# EAGLE board r (EAGLE 9.6.2), part 1 of 2
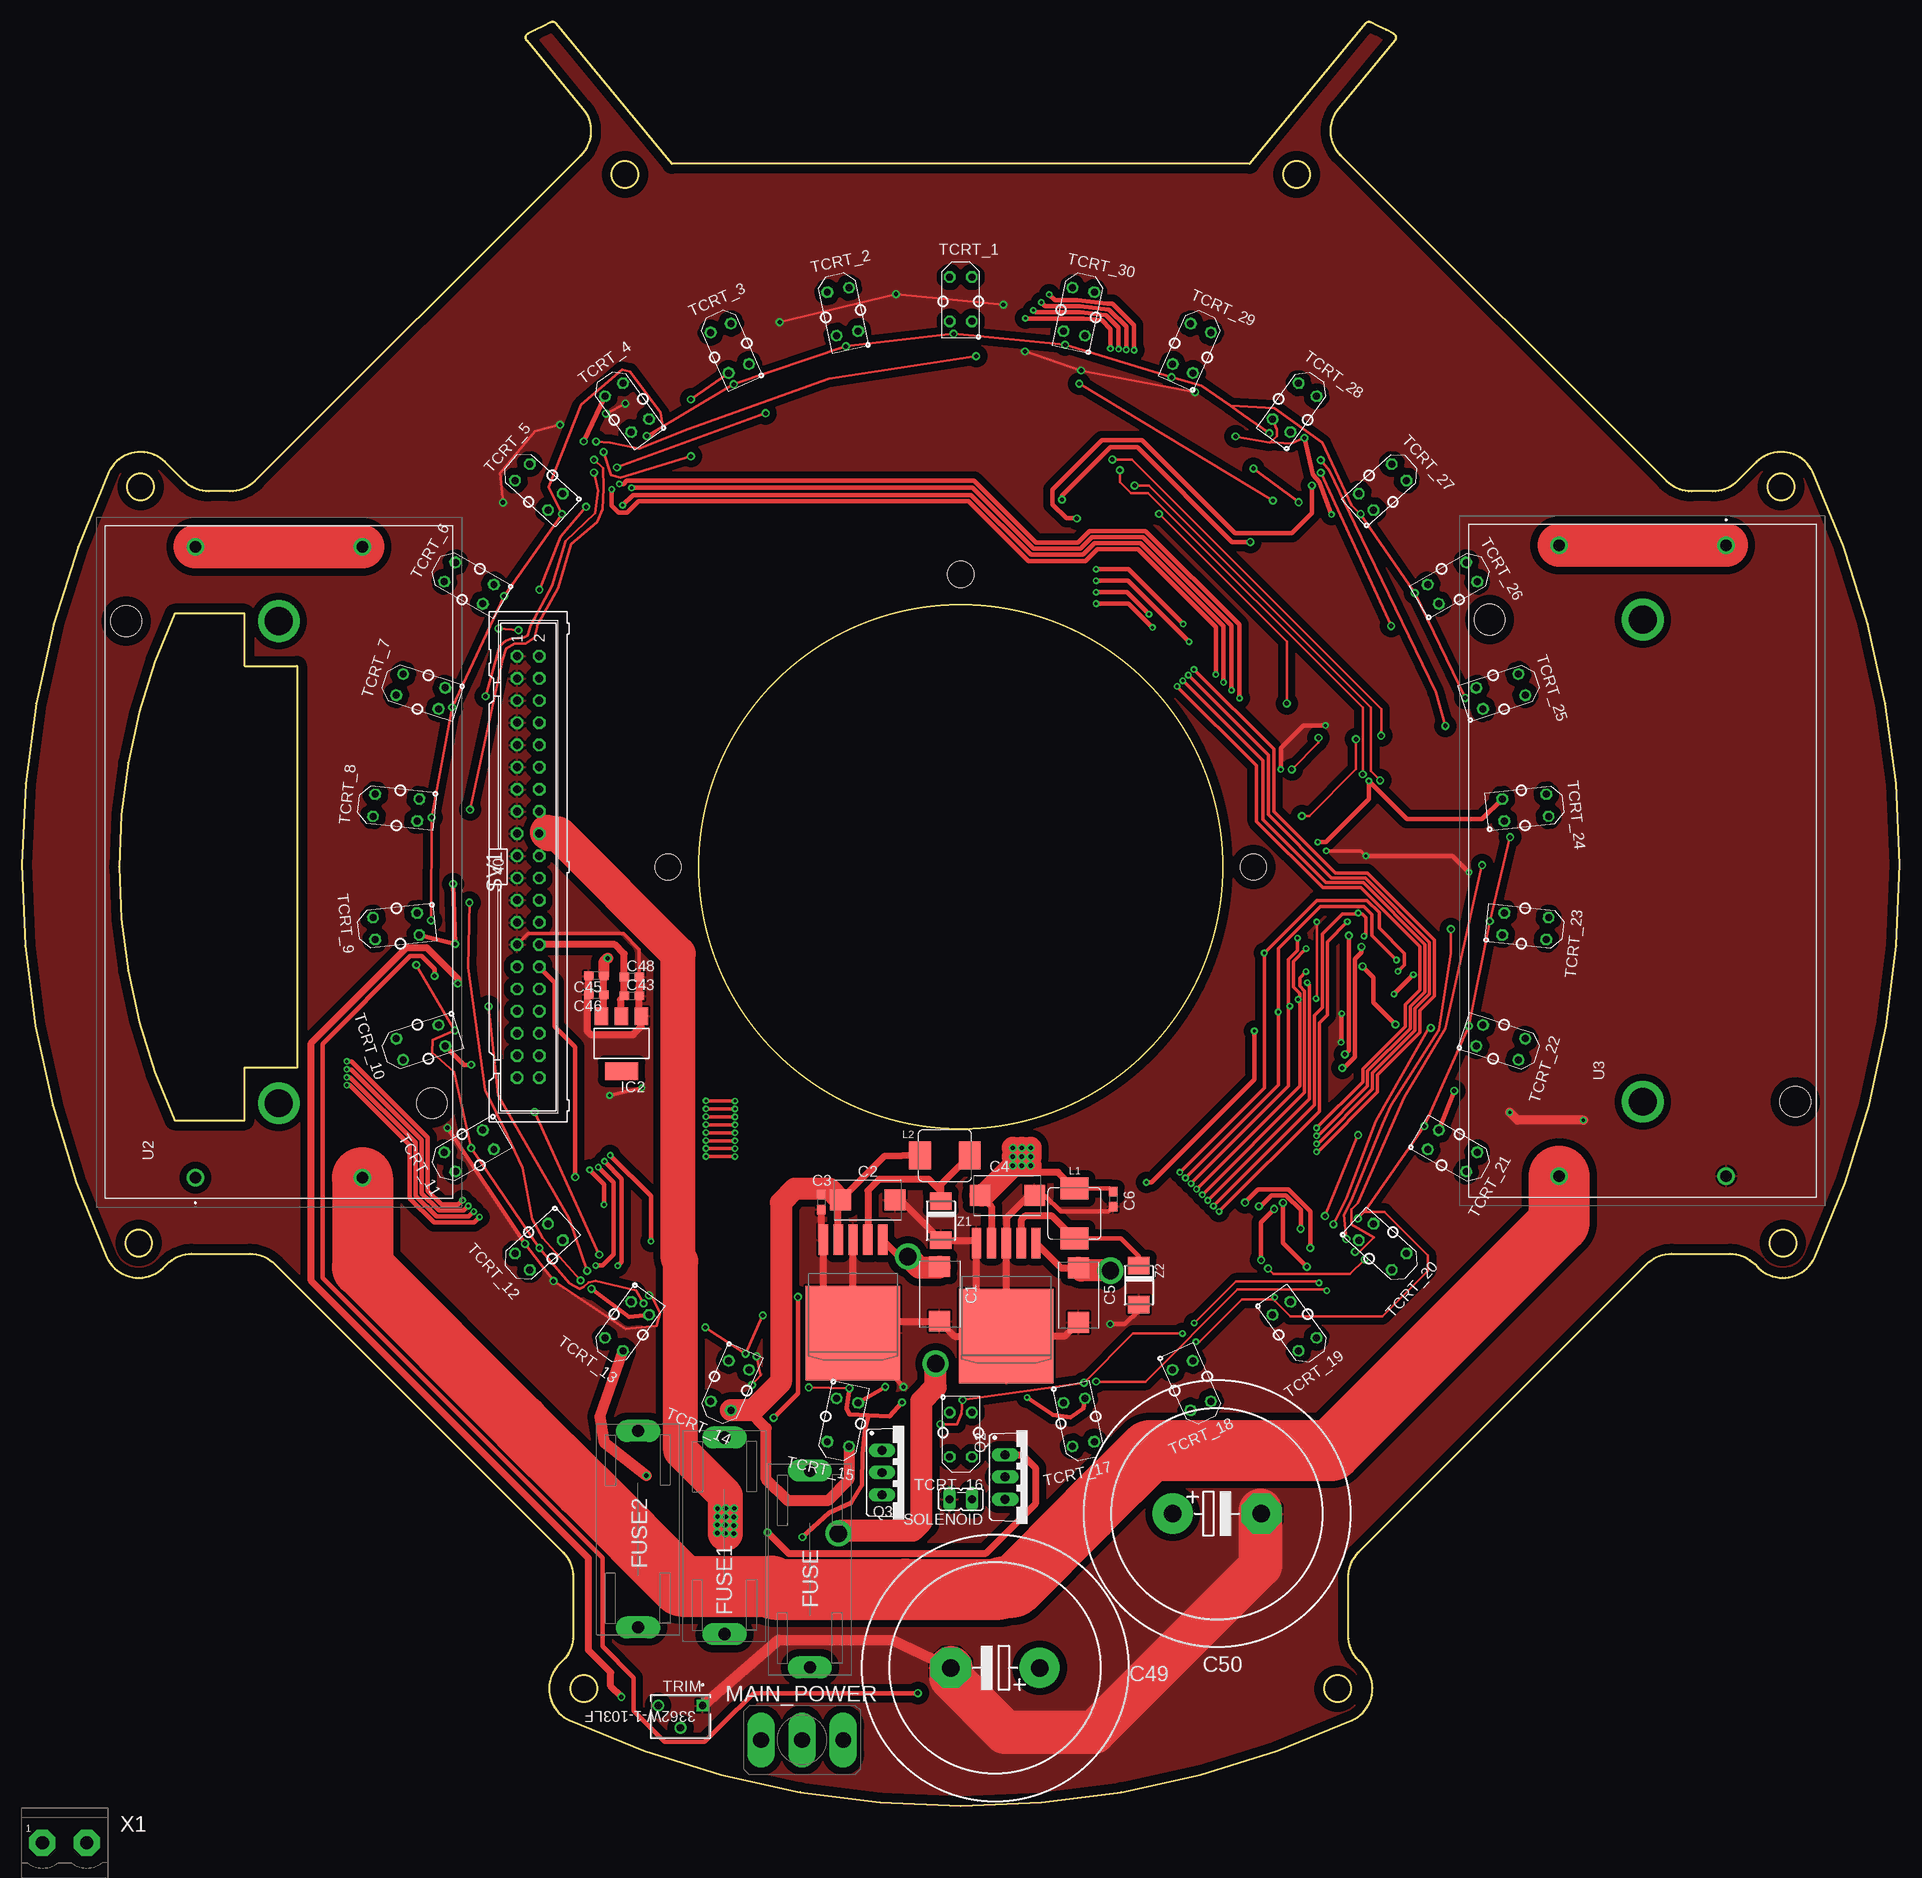
[diagram p2: board, top side]
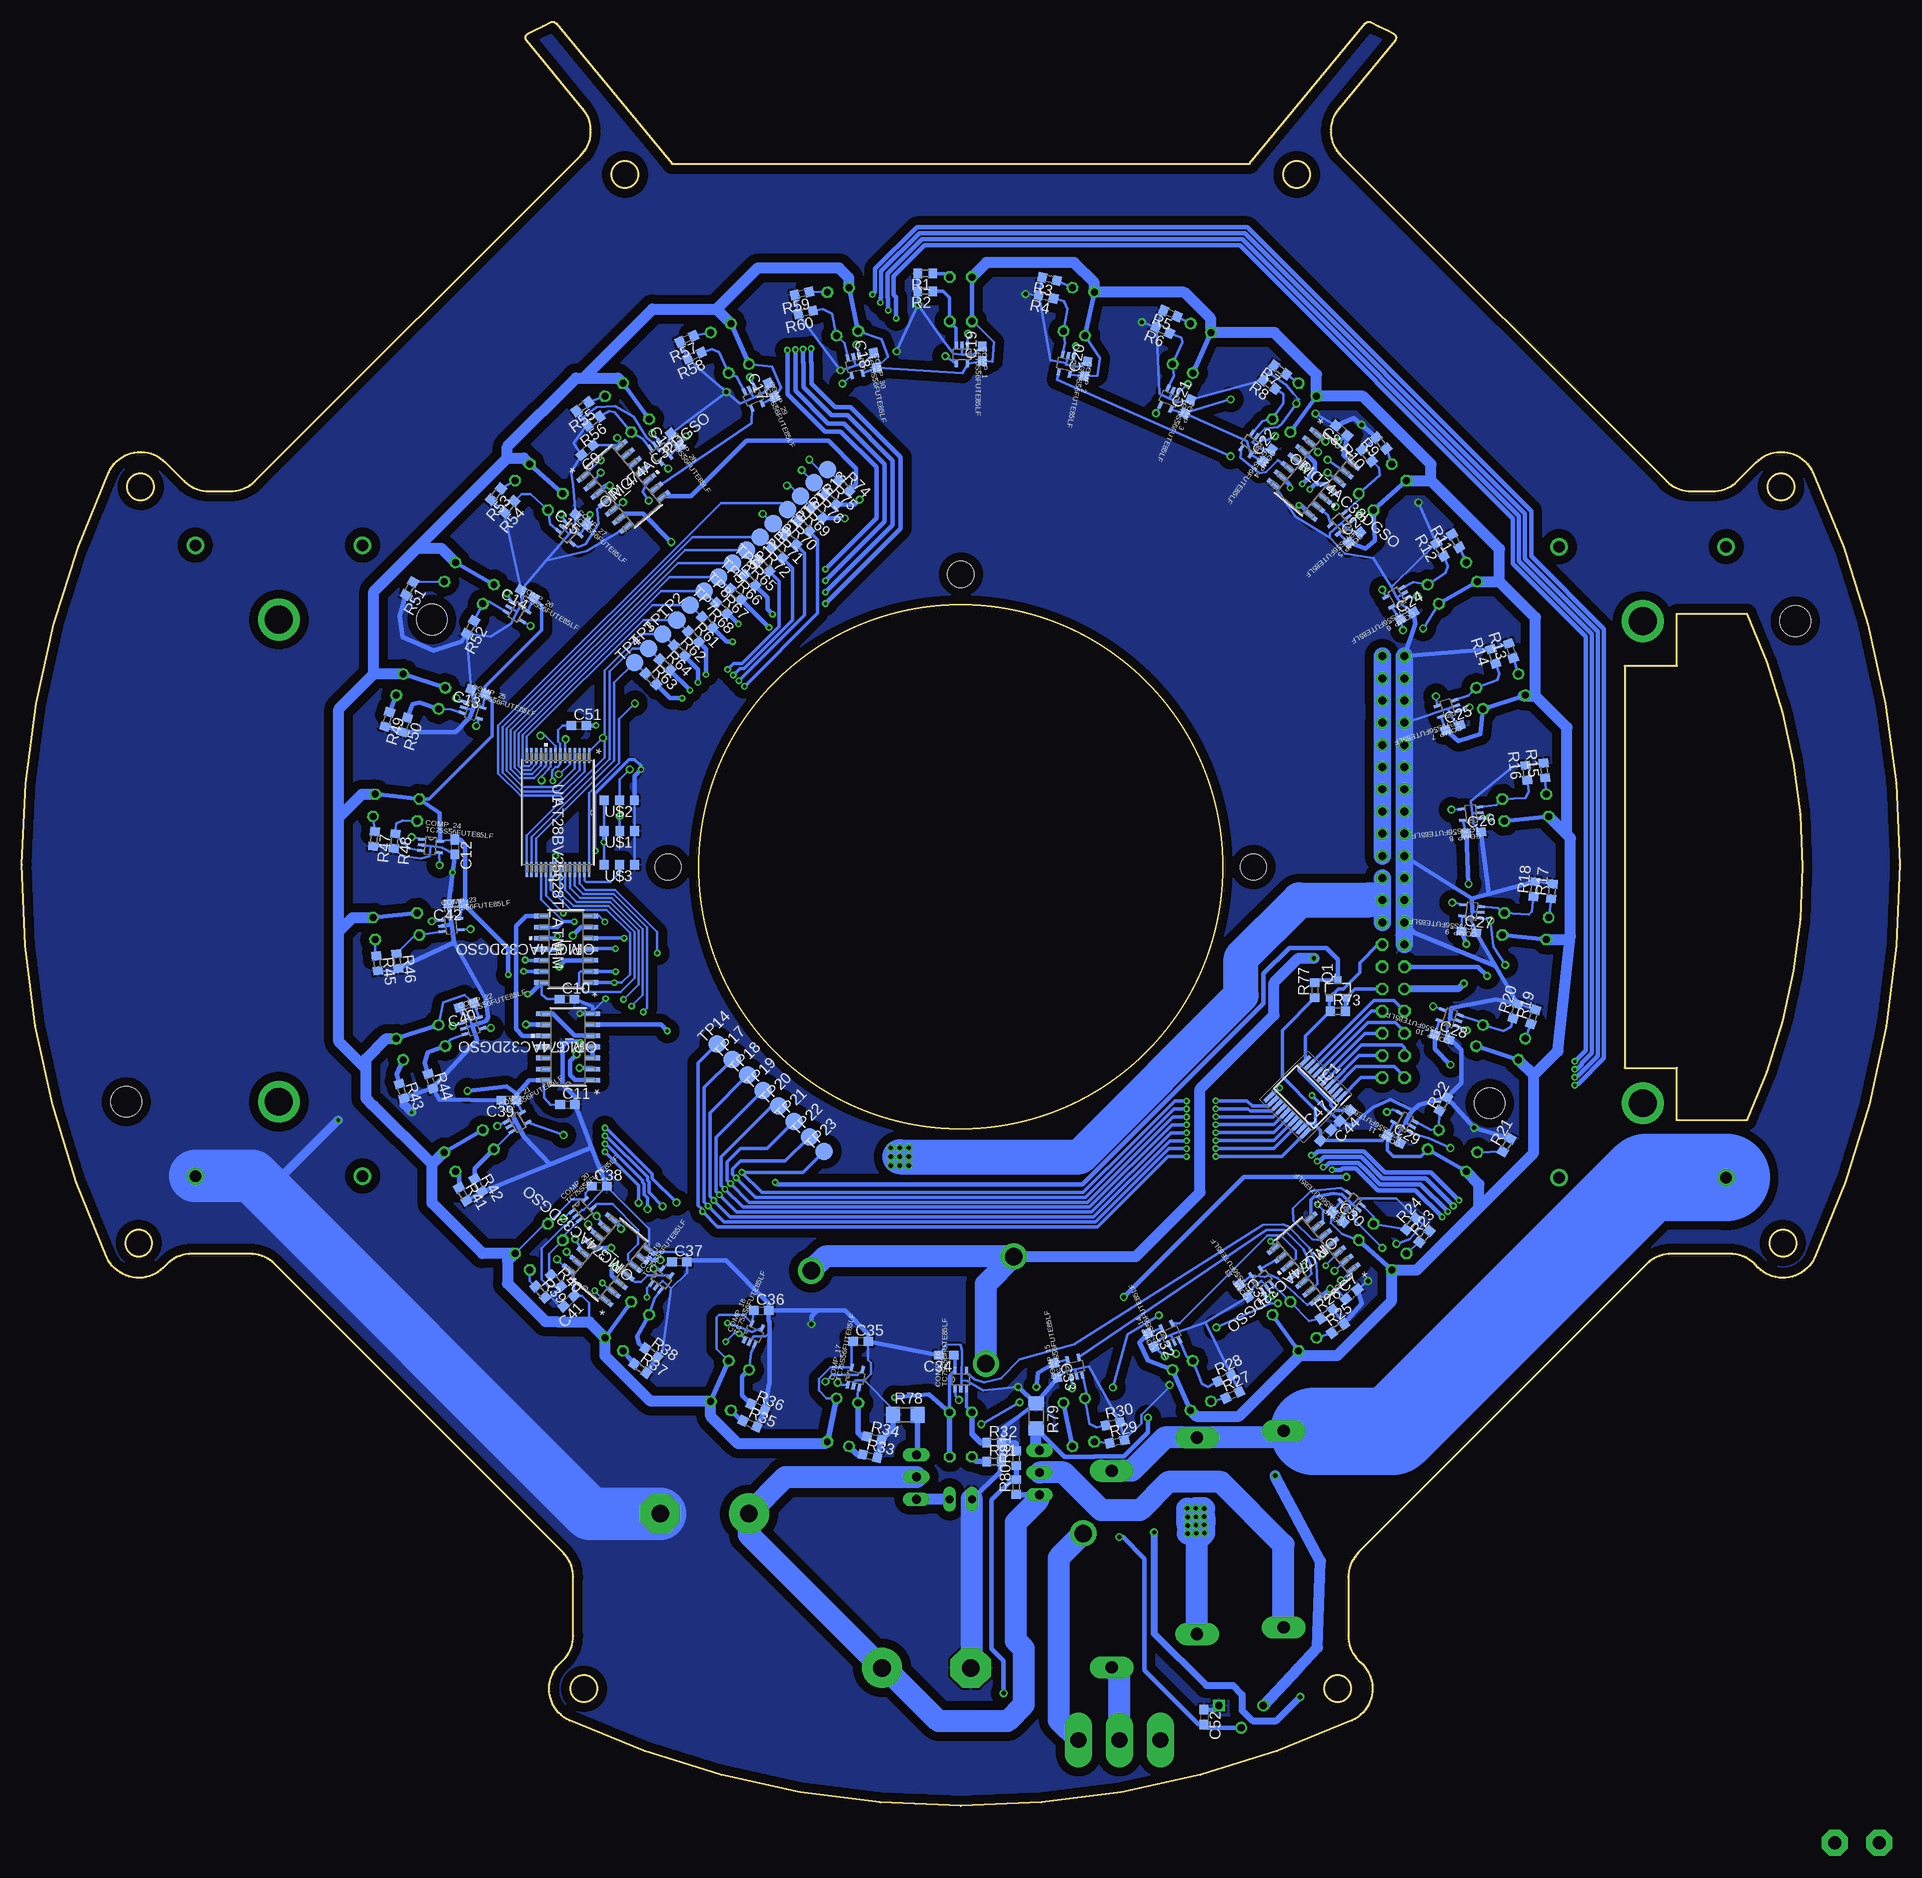
[diagram p3: board, bottom side, seen from below]

Size 215 x 204.26 mm. Coordinates in mm from the lower left corner, seen from the top.
Outline: 140.55,188 74.44,188 61.15,204.08 arc76 60.55,204.21 arc2 57.92,202.89 arc102 57.77,202.12 64.23,194.31 arc-85 63.97,188.94 26.67,151.67 arc-45 23.84,150.5 21.42,150.5 arc-45 18.59,151.67 16.42,153.84 arc110 9.96,152.7 arc49 9.74,62.79 arc110 16.2,61.62 16.62,62.03 arc-45 19.44,63.2 26.13,63.2 arc-45 28.96,62.03 61.96,29 arc-45 63.13,26.18 63.13,19.49 arc-45 61.95,16.66 61.54,16.25 arc110 62.7,9.78 arc49 152.3,9.78 arc110 153.46,16.25 153.04,16.66 arc-45 151.87,19.49 151.87,26.18 arc-45 153.04,29 186.04,62.03 arc-45 188.87,63.2 195.55,63.2 arc-45 198.38,62.03 198.79,61.62 arc110 205.26,62.79 arc49 205.04,152.7 arc110 198.58,153.84 196.41,151.67 arc-45 193.58,150.5 191.16,150.5 arc-45 188.33,151.67 151.03,188.94 arc-85 150.77,194.31 157.23,202.12 arc102 157.08,202.89 arc2 154.45,204.21 arc76 153.84,204.08 140.55,188
Outline: 17.5,136.5 arc49 17.5,78.5 25.5,78.5 25.5,84.5 31.5,84.5 31.5,130.5 25.5,130.5 25.5,136.5 17.5,136.5
Outline: circle at 13.59,151.02 radius 1.5
Outline: circle at 69.05,186.78 radius 1.5
Outline: circle at 13.38,64.45 radius 1.5
Outline: circle at 64.37,13.42 radius 1.5
Outline: circle at 150.63,13.42 radius 1.5
Outline: circle at 201.62,64.45 radius 1.5
Outline: circle at 145.95,186.78 radius 1.5
Outline: circle at 201.41,151.02 radius 1.5
Outline: circle at 107.5,107.5 radius 30
Copper layers (1*16): Top 0.035mm / dielectric 1.5mm / Bottom 0.035mm
Design rules "default *": minimum track width 0.3mm, minimum drill 0.35mm, track to track 6mil, track to pad 6mil, pad to pad 6mil, via to via 6mil, smd to smd 6mil, copper to edge 40mil, drill to drill 6mil, minimum pad ring 10mil, minimum via ring 8mil, stop-mask expansion 4mil, vias tented up to drill 0mil, thermal gap 10mil
Holes 3 mm at 141,107.5 74,107.5 107.5,141

## Footprints (pad centres in the part's own frame; a part is rotated, then mirrored left to right if it is on the bottom)
CAPM7343X310 = smd 2.368 x 2.404: 1 -3.121,0; 2 3.121,0
C0603 = smd 1.1 x 1: 1 -0.85,0; 2 0.85,0
EB30D = drill 2.007 pad 4.597: + -5.08,0 | drill 2.007 pad 4.597 octagon: - 5.08,0
SOT-353___(USV)_TOS = smd 0.833 x 0.355: 1 -1.039,0.65; 2 -1.039,0; 3 -1.039,-0.65; 4 1.039,-0.65; 5 1.039,0.65
SH22,5A = drill 1.397 pad 2.54 long: 1 -11.252,0; 2 11.252,0
SOP65P640X120-20N = smd 1.475 x 0.45: 1 -2.938,2.925; 2 -2.938,2.275; 3 -2.938,1.625; 4 -2.938,0.975; 5 -2.938,0.325; 6 -2.938,-0.325; 7 -2.938,-0.975; 8 -2.938,-1.625; 9 -2.938,-2.275; 10 -2.938,-2.925; 11 2.938,-2.925; 12 2.938,-2.275; 13 2.938,-1.625; 14 2.938,-0.975; 15 2.938,-0.325; 16 2.938,0.325; 17 2.938,0.975; 18 2.938,1.625; 19 2.938,2.275; 20 2.938,2.925
SOT223 = smd 1.499 x 2.007: 1 -2.261,-3.15; 2 0.025,-3.15; 3 2.311,-3.15 | smd 3.81 x 2.007: 4 0,3.15
TO263-5 = smd 1.067 x 3.505: 1 -3.404,0.762; 2 -1.702,0.762; 3 0,0.762; 4 1.702,0.762; 5 3.404,0.762 | smd 10.82 x 10.82: 6 0,11.43
INDUCTOR_L0630 = smd 2.5 x 3.2: 1 -2.85,0; 2 2.85,0
P-B069B = drill 1.803 pad 3.175 long: 1 -4.699,0; 2 0,0; 3 4.699,0
SOIC-14_NB_ONS-M = smd 1.702 x 0.533: 1 -2.807,3.81; 2 -2.807,2.54; 3 -2.807,1.27; 4 -2.807,0; 5 -2.807,-1.27; 6 -2.807,-2.54; 7 -2.807,-3.81; 8 2.807,-3.81; 9 2.807,-2.54; 10 2.807,-1.27; 11 2.807,0; 12 2.807,1.27; 13 2.807,2.54; 14 2.807,3.81
SOT23 = smd 0.8 x 0.9: 1 -0.95,-1; 2 0.95,-1; 3 0,1
TO220BV = drill 1.016 long: D 0,-2.54; G -2.54,-2.54; S 2.54,-2.54
R0603 = smd 1 x 1.1: 1 -0.85,0; 2 0.85,0
R1206 = smd 1.6 x 1.803: 1 -1.422,0; 2 1.422,0
JP1 = drill 0.914 long: 1 0,-1.27; 2 0,1.27
ML40 = drill 0.914 octagon: 1 -24.13,-1.27; 2 -24.13,1.27; 3 -21.59,-1.27; 4 -21.59,1.27; 5 -19.05,-1.27; 6 -19.05,1.27; 7 -16.51,-1.27; 8 -16.51,1.27; 9 -13.97,-1.27; 10 -13.97,1.27; 11 -11.43,-1.27; 12 -11.43,1.27; 13 -8.89,-1.27; 14 -8.89,1.27; 15 -6.35,-1.27; 16 -6.35,1.27; 17 -3.81,-1.27; 18 -3.81,1.27; 19 -1.27,-1.27; 20 -1.27,1.27; 21 1.27,-1.27; 22 1.27,1.27; 23 3.81,-1.27; 24 3.81,1.27; 25 6.35,-1.27; 26 6.35,1.27; 27 8.89,-1.27; 28 8.89,1.27; 29 11.43,-1.27; 30 11.43,1.27; 31 13.97,-1.27; 32 13.97,1.27; 33 16.51,-1.27; 34 16.51,1.27; 35 19.05,-1.27; 36 19.05,1.27; 37 21.59,-1.27; 38 21.59,1.27; 39 24.13,-1.27; 40 24.13,1.27
TCRT5000 = drill 0.8 octagon: A -2.54,-1.27; C 2.54,-1.27; E 2.54,1.27; K -2.54,1.27
TP20R = smd 2 x 2: TP 0,0
POT_3362W = drill 0.838 pad 1.346 square: 1 0,0 | drill 0.838 pad 1.346: 2 2.54,2.54; 3 5.08,0
28T_ATM-M = smd 1.716 x 0.27: 1 -6.501,3.575; 2 -6.501,3.025; 3 -6.501,2.475; 4 -6.501,1.925; 5 -6.501,1.375; 6 -6.501,0.825; 7 -6.501,0.275; 8 -6.501,-0.275; 9 -6.501,-0.825; 10 -6.501,-1.375; 11 -6.501,-1.925; 12 -6.501,-2.475; 13 -6.501,-3.025; 14 -6.501,-3.575; 15 6.501,-3.575; 16 6.501,-3.025; 17 6.501,-2.475; 18 6.501,-1.925; 19 6.501,-1.375; 20 6.501,-0.825; 21 6.501,-0.275; 22 6.501,0.275; 23 6.501,0.825; 24 6.501,1.375; 25 6.501,1.925; 26 6.501,2.475; 27 6.501,3.025; 28 6.501,3.575
1049P = drill 1.32 pad 1.98: 1 0,0; 2 0,-19.13; 3 72.22,-19.13; 4 72.22,0 | drill 3.18 pad 4.77: 5 8.51,-9.55; 6 63.71,-9.55 | hole 3.55: 8.51,-27.08; 63.71,7.92
0603_S = smd 1 x 1.1: 1 -0.85,0; 2 0.85,0; 3 2.628,0
ML2 = drill 1.524 pad 2.997 octagon: 1 -2.54,0; 2 2.54,0
SUPRESSOR_SMAJ = smd 2 x 2.5: A 2.223,0; C -2.223,0

## Placement (x,y rotation side)
C1  330uF  [CAPM7343X310]  105.09,58.61 270 top
C2  220uF  [CAPM7343X310]  96.85,69.39 0 top
C3  100nF  [C0603]  91.53,69.13 270 top
C4  220uF  [CAPM7343X310]  112.83,69.91 0 top
C5  330uF  [CAPM7343X310]  120.96,58.48 270 top
C6  100nF  [C0603]  124.94,69.46 270 top
C7  100nF  [C0603]  62.75,58.59 40 bottom
C8  100nF  [C0603]  63.88,157.46 140 bottom
C9  100nF  [C0603]  150.27,155.22 220 bottom
C10  100nF  [C0603]  152.58,92.36 0 bottom
C11  100nF  [C0603]  152.52,80.3 0 bottom
C12  100nF  [C0603]  165.41,109.8 270 bottom
C13  100nF  [C0603]  162.75,127.57 162 bottom
C14  100nF  [C0603]  157.12,138.78 150 bottom
C15  100nF  [C0603]  150.97,147.28 138 bottom
C16  100nF  [C0603]  140.18,156.41 126 bottom
C17  100nF  [C0603]  129.18,162.09 114 bottom
C18  100nF  [C0603]  117.31,165.52 102 bottom
C19  100nF  [C0603]  105.05,166.27 90 bottom
C20  100nF  [C0603]  93.2,164.53 78 bottom
C21  100nF  [C0603]  81.52,160.23 66 bottom
C22  100nF  [C0603]  72.4,154.6 54 bottom
C23  100nF  [C0603]  62.42,145.21 42 bottom
C24  100nF  [C0603]  56.42,136.23 30 bottom
C25  100nF  [C0603]  51.16,123.44 18 bottom
C26  100nF  [C0603]  48.79,111.41 6 bottom
C27  100nF  [C0603]  49.34,100.06 354 bottom
C28  100nF  [C0603]  52.42,88.01 342 bottom
C29  100nF  [C0603]  57.92,76.32 330 bottom
C30  100nF  [C0603]  64.35,67.45 318 bottom
C31  100nF  [C0603]  75.11,58.97 306 bottom
C32  100nF  [C0603]  85.73,53.32 294 bottom
C33  100nF  [C0603]  96.63,49.85 282 bottom
C34  100nF  [C0603]  109.17,51.6 180 bottom
C35  100nF  [C0603]  118.96,53.18 0 bottom
C36  100nF  [C0603]  130.34,56.72 0 bottom
C37  100nF  [C0603]  139.7,62.28 0 bottom
C38  100nF  [C0603]  148.87,70.95 0 bottom
C39  100nF  [C0603]  159.24,80.79 180 bottom
C40  100nF  [C0603]  164.08,91.69 198 bottom
C41  100nF  [C0603]  152.37,57.81 225 bottom
C42  100nF  [C0603]  165.3,103.29 180 bottom
C43  10uF  [C0603]  69.83,92.75 0 top
C44  100nF  [C0603]  63.51,79 225 bottom
C45  100nF  [C0603]  65.76,95.03 180 top
C46  10uF  [C0603]  65.76,92.87 180 top
C47  100nF  [C0603]  65.72,76.79 45 bottom
C48  100nF  [C0603]  69.83,94.91 0 top
C49  [EB30D]  111.44,15.81 180 top
C50  [EB30D]  136.84,33.46 0 top
C51  100nF  [C0603]  151.22,123.7 0 bottom
C52  100nF  [C0603]  79.66,10.18 270 bottom
COMP_1  TC75S56FUTE85LF  [SOT-353___(USV)_TOS]  107.37,166.18 270 bottom
COMP_2  TC75S56FUTE85LF  [SOT-353___(USV)_TOS]  95.43,165.03 258 bottom
COMP_3  TC75S56FUTE85LF  [SOT-353___(USV)_TOS]  83.62,161.1 246 bottom
COMP_4  TC75S56FUTE85LF  [SOT-353___(USV)_TOS]  74.22,155.93 234 bottom
COMP_5  TC75S56FUTE85LF  [SOT-353___(USV)_TOS]  63.94,146.87 222 bottom
COMP_6  TC75S56FUTE85LF  [SOT-353___(USV)_TOS]  57.59,138.36 210 bottom
COMP_7  TC75S56FUTE85LF  [SOT-353___(USV)_TOS]  51.76,125.64 198 bottom
COMP_8  TC75S56FUTE85LF  [SOT-353___(USV)_TOS]  49.08,113.6 186 bottom
COMP_9  TC75S56FUTE85LF  [SOT-353___(USV)_TOS]  49.01,102.42 174 bottom
COMP_10  TC75S56FUTE85LF  [SOT-353___(USV)_TOS]  51.51,90.22 162 bottom
COMP_11  TC75S56FUTE85LF  [SOT-353___(USV)_TOS]  56.7,78.29 150 bottom
COMP_12  TC75S56FUTE85LF  [SOT-353___(USV)_TOS]  62.77,69.01 138 bottom
COMP_13  TC75S56FUTE85LF  [SOT-353___(USV)_TOS]  73.08,60.26 126 bottom
COMP_14  TC75S56FUTE85LF  [SOT-353___(USV)_TOS]  83.5,54.03 114 bottom
COMP_15  TC75S56FUTE85LF  [SOT-353___(USV)_TOS]  94.43,50.22 102 bottom
COMP_16  TC75S56FUTE85LF  [SOT-353___(USV)_TOS]  107.5,48.83 90 bottom
COMP_17  TC75S56FUTE85LF  [SOT-353___(USV)_TOS]  119.56,49.08 78 bottom
COMP_18  TC75S56FUTE85LF  [SOT-353___(USV)_TOS]  131.25,54.03 66 bottom
COMP_19  TC75S56FUTE85LF  [SOT-353___(USV)_TOS]  141.79,60.26 54 bottom
COMP_20  TC75S56FUTE85LF  [SOT-353___(USV)_TOS]  150.81,68.26 42 bottom
COMP_21  TC75S56FUTE85LF  [SOT-353___(USV)_TOS]  158.3,78.29 30 bottom
COMP_22  TC75S56FUTE85LF  [SOT-353___(USV)_TOS]  163.41,89.32 18 bottom
COMP_23  TC75S56FUTE85LF  [SOT-353___(USV)_TOS]  165.86,100.86 6 bottom
COMP_24  TC75S56FUTE85LF  [SOT-353___(USV)_TOS]  168.21,109.91 354 bottom
COMP_25  TC75S56FUTE85LF  [SOT-353___(USV)_TOS]  163.43,125.44 342 bottom
COMP_26  TC75S56FUTE85LF  [SOT-353___(USV)_TOS]  158.3,136.71 330 bottom
COMP_27  TC75S56FUTE85LF  [SOT-353___(USV)_TOS]  152.33,145.73 318 bottom
COMP_28  TC75S56FUTE85LF  [SOT-353___(USV)_TOS]  141.92,155 306 bottom
COMP_29  TC75S56FUTE85LF  [SOT-353___(USV)_TOS]  131.25,161.22 294 bottom
COMP_30  TC75S56FUTE85LF  [SOT-353___(USV)_TOS]  119.56,164.91 282 bottom
FUSE  T20A  [SH22,5A]  90.23,27.11 90 top
FUSE1  T10A  [SH22,5A]  80.45,30.92 90 top
FUSE2  T20A  [SH22,5A]  70.54,31.68 90 top
IC1  TXB0108PWR  [SOP65P640X120-20N]  68.04,81.17 225 bottom
IC2  LD1117  [SOT223]  68.66,87.28 180 top
IO1  LM2596S-5  [TO263-5]  112.71,65.21 180 top
IO2  LM2596S-5  [TO263-5]  95.16,65.58 180 top
L1  22UH  [INDUCTOR_L0630]  120.5,67.83 90 top
L2  22UH  [INDUCTOR_L0630]  105.68,74.45 180 top
MAIN_POWER  [P-B069B]  89.34,7.55 0 top
OR_1  MC74AC32DGSO  [SOIC-14_NB_ONS-M]  67.11,152.46 320 bottom
OR_2  MC74AC32DGSO  [SOIC-14_NB_ONS-M]  67.11,62.67 220 bottom
OR_3  MC74AC32DGSO  [SOIC-14_NB_ONS-M]  147.76,62.54 140 bottom
OR_4  MC74AC32DGSO  [SOIC-14_NB_ONS-M]  146.13,151.07 40 bottom
OR_5  MC74AC32DGSO  [SOIC-14_NB_ONS-M]  152.7,98.07 180 bottom
OR_6  MC74AC32DGSO  [SOIC-14_NB_ONS-M]  152.45,86.9 180 bottom
Q1  BSS138  [SOT23]  64.32,93.53 0 bottom
Q2  [TO220BV]  115.12,37.65 270 top
Q3  [TO220BV]  101.02,38.16 270 top
R1  1K  [R0603]  111.56,175.45 180 bottom
R2  10K  [R0603]  111.56,173.41 180 bottom
R3  1K  [R0603]  97.34,174.81 168 bottom
R4  10K  [R0603]  97.72,172.78 168 bottom
R5  1K  [R0603]  83.5,170.87 156 bottom
R6  10K  [R0603]  84.39,168.97 156 bottom
R7  1K  [R0603]  70.92,164.4 144 bottom
R8  10K  [R0603]  72.19,162.75 144 bottom
R9  1K  [R0603]  59.37,156.02 132 bottom
R10  10K  [R0603]  61.02,154.62 132 bottom
R11  1K  [R0603]  50.86,144.84 120 bottom
R12  10K  [R0603]  52.64,143.82 120 bottom
R13  1K  [R0603]  44.51,132.27 108 bottom
R14  10K  [R0603]  46.54,131.63 108 bottom
R15  1K  [R0603]  40.7,118.55 96 bottom
R16  10K  [R0603]  42.73,118.3 96 bottom
R17  1K  [R0603]  39.81,104.71 84 bottom
R18  10K  [R0603]  41.84,104.96 84 bottom
R19  1K  [R0603]  41.97,90.36 72 bottom
R20  10K  [R0603]  44,90.99 72 bottom
R21  1K  [R0603]  45.01,75.66 60 bottom
R22  10K  [R0603]  52.26,80.36 60 bottom
R23  1K  [R0603]  54.41,65.21 48 bottom
R24  10K  [R0603]  55.94,66.61 48 bottom
R25  1K  [R0603]  64.32,54.67 36 bottom
R26  10K  [R0603]  65.59,56.32 36 bottom
R27  1K  [R0603]  76.38,47.05 24 bottom
R28  10K  [R0603]  77.27,48.95 24 bottom
R29  1K  [R0603]  89.59,41.72 12 bottom
R30  10K  [R0603]  90.1,43.75 12 bottom
R31  1K  [R0603]  103.69,39.43 0 bottom
R32  10K  [R0603]  103.69,41.59 0 bottom
R33  1K  [R0603]  117.91,40.06 348 bottom
R34  10K  [R0603]  117.41,42.1 348 bottom
R35  1K  [R0603]  131.63,43.75 336 bottom
R36  10K  [R0603]  130.74,45.65 336 bottom
R37  1K  [R0603]  144.2,50.1 324 bottom
R38  10K  [R0603]  142.93,51.88 324 bottom
R39  1K  [R0603]  155.63,58.86 312 bottom
R40  10K  [R0603]  153.85,60.13 312 bottom
R41  1K  [R0603]  164.52,70.04 300 bottom
R42  10K  [R0603]  162.74,71.05 300 bottom
R43  1K  [R0603]  171.51,81.85 288 bottom
R44  10K  [R0603]  168.21,82.99 288 bottom
R45  1K  [R0603]  174.32,96.46 276 bottom
R46  10K  [R0603]  172,96.72 276 bottom
R47  1K  [R0603]  174.68,110.72 264 bottom
R48  10K  [R0603]  172.33,110.47 264 bottom
R49  1K  [R0603]  173.16,124.39 252 bottom
R50  10K  [R0603]  171.13,123.76 252 bottom
R51  1K  [R0603]  170.62,139.38 240 bottom
R52  10K  [R0603]  163.63,134.93 240 bottom
R53  1K  [R0603]  160.71,150.17 228 bottom
R54  10K  [R0603]  159.19,148.78 228 bottom
R55  1K  [R0603]  150.81,160.21 216 bottom
R56  10K  [R0603]  149.54,158.56 216 bottom
R57  1K  [R0603]  138.87,167.95 204 bottom
R58  10K  [R0603]  137.98,166.05 204 bottom
R59  1K  [R0603]  125.66,173.16 192 bottom
R60  10K  [R0603]  125.28,171 192 bottom
R61  0R  [R0603]  138.12,133.87 315 bottom
R62  0R  [R0603]  139.74,132.26 315 bottom
R63  0R  [R0603]  142.97,129.02 315 bottom
R64  0R  [R0603]  141.36,130.64 315 bottom
R65  0R  [R0603]  131.66,140.34 315 bottom
R66  0R  [R0603]  133.28,138.72 315 bottom
R67  0R  [R0603]  134.89,137.11 315 bottom
R68  0R  [R0603]  136.51,135.49 315 bottom
R69  0R  [R0603]  125.46,146.54 315 bottom
R70  0R  [R0603]  126.99,145.01 315 bottom
R71  0R  [R0603]  128.52,143.48 315 bottom
R72  0R  [R0603]  130.04,141.96 315 bottom
R73  10K  [R0603]  64.32,90.99 0 bottom
R74  0R  [R0603]  120.88,151.12 315 bottom
R75  0R  [R0603]  122.41,149.59 315 bottom
R76  0R  [R0603]  123.94,148.06 315 bottom
R77  10K  [R0603]  66.97,93.39 90 bottom
R78  10K  [R1206]  113.85,44.76 0 bottom
R79  10K  [R1206]  98.86,44.64 270 bottom
R80  10K  [R0603]  101.15,36.51 90 bottom
R81  2K  [R0603]  101.15,39.81 90 bottom
SOLENOID  [JP1]  107.5,35.11 90 top
SV1  [ML40]  57.97,107.5 270 top
TCRT_1  [TCRT5000]  107.5,172.5 270 top
TCRT_2  [TCRT5000]  93.99,171.08 282 top
TCRT_3  [TCRT5000]  81.06,166.88 294 top
TCRT_4  [TCRT5000]  69.29,160.09 306 top
TCRT_5  [TCRT5000]  59.2,150.99 318 top
TCRT_6  [TCRT5000]  51.21,140 330 top
TCRT_7  [TCRT5000]  45.68,127.59 342 top
TCRT_8  [TCRT5000]  42.86,114.3 354 top
TCRT_9  [TCRT5000]  42.86,100.71 6 top
TCRT_10  [TCRT5000]  45.68,87.42 18 top
TCRT_11  [TCRT5000]  51.21,75 30 top
TCRT_12  [TCRT5000]  59.2,64.01 42 top
TCRT_13  [TCRT5000]  69.29,54.92 54 top
TCRT_14  [TCRT5000]  81.06,48.12 66 top
TCRT_15  [TCRT5000]  93.99,43.92 78 top
TCRT_16  [TCRT5000]  107.5,42.5 90 top
TCRT_17  [TCRT5000]  121.01,43.92 102 top
TCRT_18  [TCRT5000]  133.94,48.12 114 top
TCRT_19  [TCRT5000]  145.71,54.92 126 top
TCRT_20  [TCRT5000]  155.8,64.01 138 top
TCRT_21  [TCRT5000]  163.79,75 150 top
TCRT_22  [TCRT5000]  169.32,87.42 162 top
TCRT_23  [TCRT5000]  172.14,100.71 174 top
TCRT_24  [TCRT5000]  172.14,114.3 186 top
TCRT_25  [TCRT5000]  169.32,127.59 198 top
TCRT_26  [TCRT5000]  163.79,140 210 top
TCRT_27  [TCRT5000]  155.8,150.99 222 top
TCRT_28  [TCRT5000]  145.71,160.09 234 top
TCRT_29  [TCRT5000]  133.94,166.88 246 top
TCRT_30  [TCRT5000]  121.01,171.08 258 top
TP1  PTR1TP20R  [TP20R]  141.63,134.14 45 bottom
TP2  PTR1TP20R  [TP20R]  140.01,135.76 45 bottom
TP3  PTR1TP20R  [TP20R]  143.24,132.53 45 bottom
TP4  PTR1TP20R  [TP20R]  144.86,130.91 45 bottom
TP5  PTR1TP20R  [TP20R]  135.25,140.7 315 bottom
TP6  PTR1TP20R  [TP20R]  133.63,142.31 315 bottom
TP7  PTR1TP20R  [TP20R]  138.48,137.47 315 bottom
TP8  PTR1TP20R  [TP20R]  136.87,139.08 315 bottom
TP9  PTR1TP20R  [TP20R]  128.96,146.8 225 bottom
TP10  PTR1TP20R  [TP20R]  127.35,148.42 225 bottom
TP11  PTR1TP20R  [TP20R]  132.02,143.75 225 bottom
TP12  PTR1TP20R  [TP20R]  130.49,145.28 225 bottom
TP13  PTR1TP20R  [TP20R]  122.77,153 225 bottom
TP14  PTR1TP20R  [TP20R]  135.42,87.21 45 bottom
TP15  PTR1TP20R  [TP20R]  125.82,149.95 225 bottom
TP16  PTR1TP20R  [TP20R]  124.29,151.47 225 bottom
TP17  PTR1TP20R  [TP20R]  133.66,85.45 45 bottom
TP18  PTR1TP20R  [TP20R]  131.89,83.68 45 bottom
TP19  PTR1TP20R  [TP20R]  130.12,81.91 45 bottom
TP20  PTR1TP20R  [TP20R]  128.36,80.15 45 bottom
TP21  PTR1TP20R  [TP20R]  126.59,78.38 45 bottom
TP22  PTR1TP20R  [TP20R]  124.83,76.61 45 bottom
TP23  PTR1TP20R  [TP20R]  123.15,74.94 45 bottom
TRIM  3362W-1-103LF  [POT_3362W]  77.94,11.49 180 top
U1  AT28BV25628T_ATM-M  [28T_ATM-M]  153.62,113.73 270 bottom
U2  1049P  [1049P]  19.87,71.94 90 top
U3  1049P  [1049P]  195.13,144.33 270 top
U$1  0603_S  [0603_S]  145.7,111.61 180 bottom
U$2  0603_S  [0603_S]  145.72,115.12 180 bottom
U$3  0603_S  [0603_S]  145.71,107.75 180 bottom
X1  [ML2]  4.89,-4.22 0 top  (outside the outline)
X2  [ML2]  4.89,-12.33 0 top  (outside the outline)
Z1  1n5824  [SUPRESSOR_SMAJ]  105.21,66.99 270 top
Z2  1n5824  [SUPRESSOR_SMAJ]  127.88,59.61 270 top